# EAGLE design can_to_usb (EAGLE 5.10)
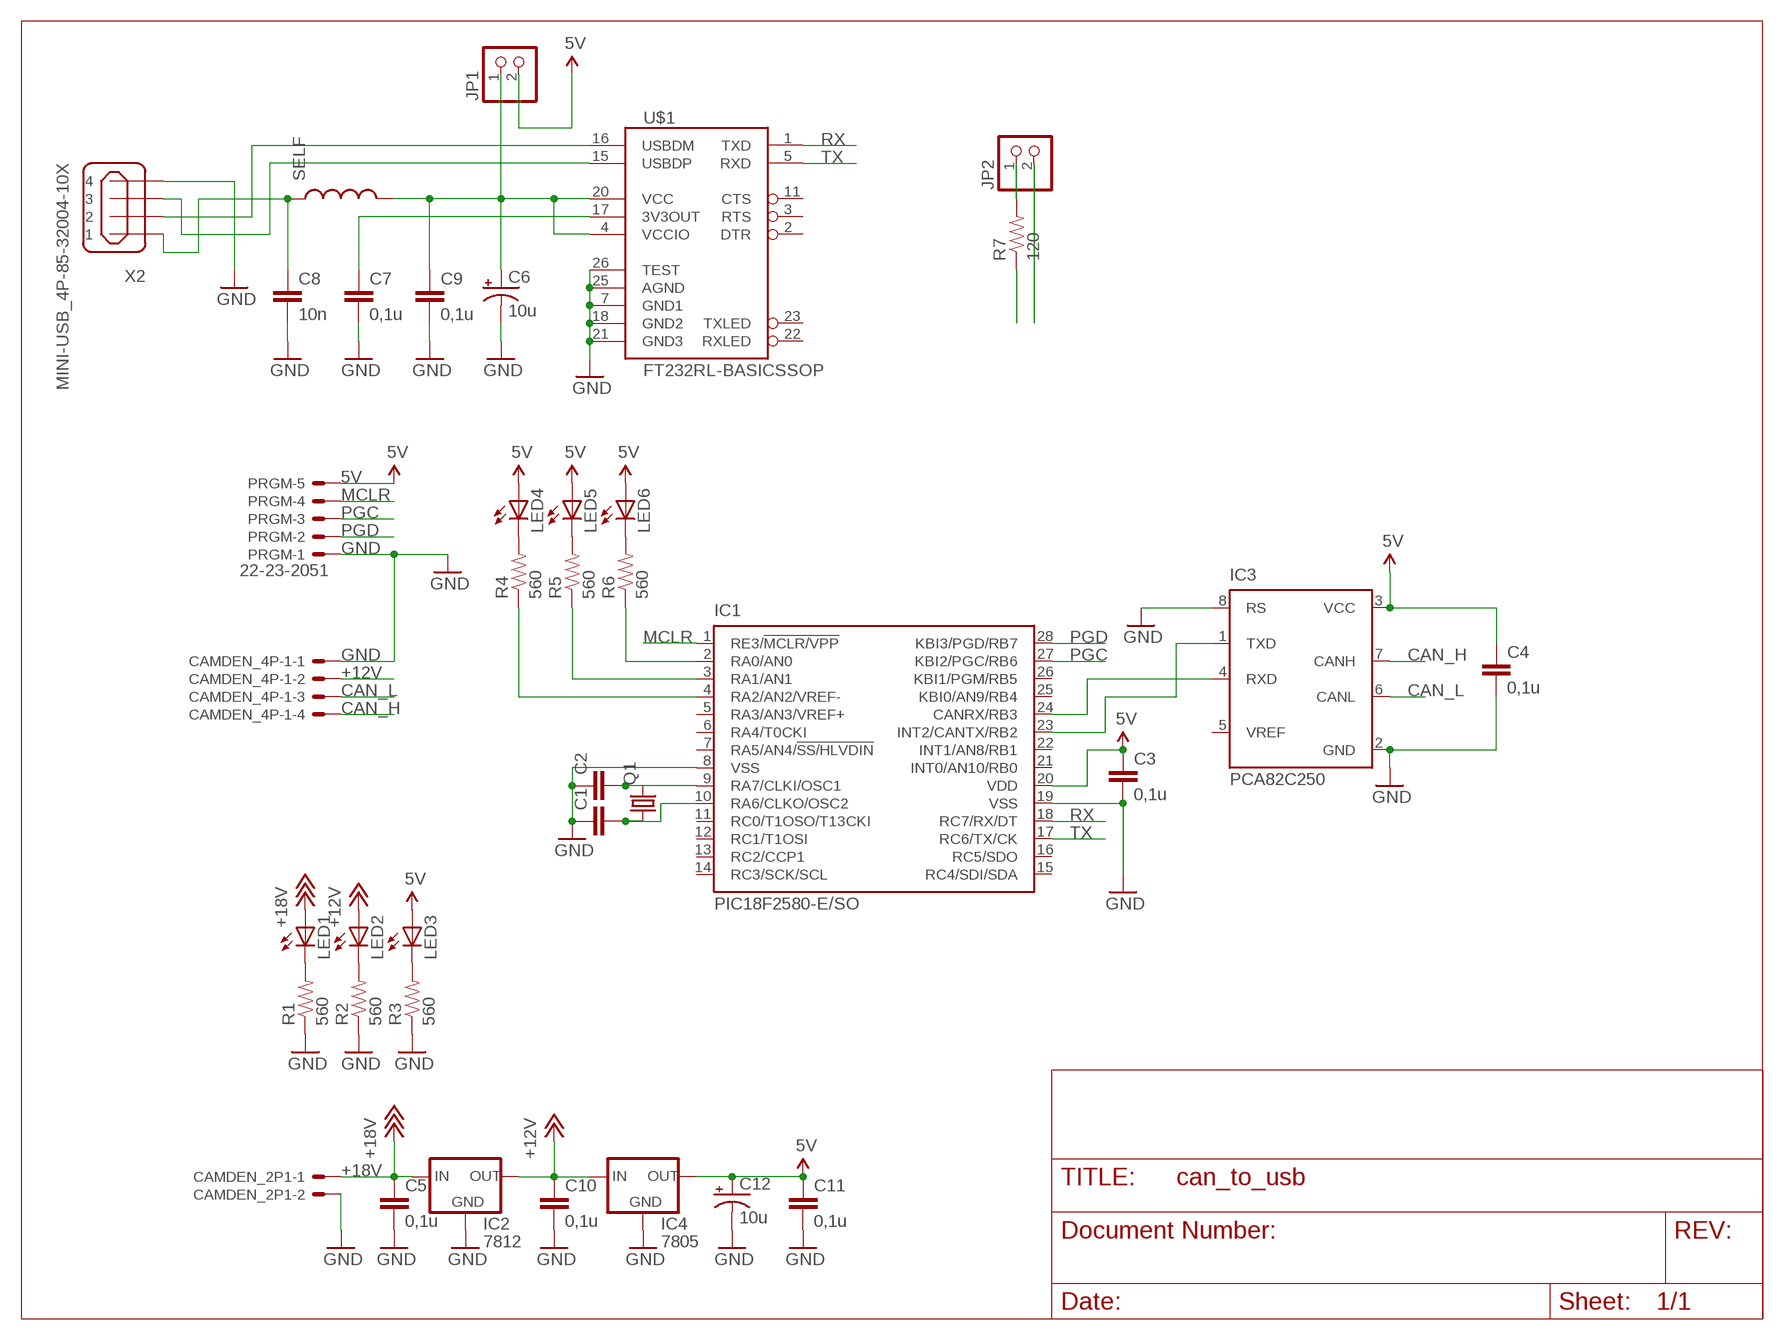
[diagram p0: schematic, sheet 1]

## Parts
C1  CAP0603  [0603]
C2  CAP0603  [0603]
C3  0,1u  CAP0603  [0603]
C4  0,1u  CAP0603  [0603]
C5  0,1u  CAP0603  [0603]
C6  10u  CAP_POL1206  [EIA3216]
C7  0,1u  CAP0603  [0603]
C8  10n  CAP0603  [0603]
C9  0,1u  CAP0603  [0603]
C10  0,1u  CAP0603  [0603]
C11  0,1u  CAP0603  [0603]
C12  10u  CAP_POL1206  [EIA3216]
CAMDEN_2P1  CTB9550-2508  [508_2]
CAMDEN_4P-1  CTB9550-4508  [508_4]
IC1  PIC18F2580-E/SO  [SO28W]
IC2  7812  78XXS  [78XXS]
IC3  PCA82C250  [DIL08]
IC4  7805  78XXS  [78XXS]
JP1  PINHD-1X2  [1X02]
JP2  PINHD-1X2  [1X02]
LED1  LED1206  [LED-1206]
LED2  LED1206  [LED-1206]
LED3  LED1206  [LED-1206]
LED4  LED1206  [LED-1206]
LED5  LED1206  [LED-1206]
LED6  LED1206  [LED-1206]
PRGM  22-23-2051  [22-23-2051]
Q1  CRYSTALHC49U-V  [HC49U-V]
R1  560  RESISTOR  [0805]
R2  560  RESISTOR  [0805]
R3  560  RESISTOR  [0805]
R4  560  RESISTOR  [0805]
R5  560  RESISTOR  [0805]
R6  560  RESISTOR  [0805]
R7  120  RESISTOR  [0805]
SELF  INDUCTOR0603  [0603]
U$1  FT232RL-BASICSSOP  [SSOP28DB]
X2  MINI-USB_4P-85-32004-10X  [85-32004-10X]

## Nets
5V: C3.1 C4.1 C11.1 C12.A(+) IC1.20(VDD) IC3.3(VCC) IC4.OUT JP1.2 LED3.A LED4.A LED5.A LED6.A PRGM.5
+12V: C10.1 CAMDEN_4P-1.P$2 IC2.OUT IC4.IN LED2.A
+18V: C5.1 CAMDEN_2P1.P$1 IC2.IN LED1.A
CAN_H: CAMDEN_4P-1.P$4 IC3.7(CANH) R7.1
CAN_L: CAMDEN_4P-1.P$3 IC3.6(CANL) JP2.2
GND: C1.1 C2.1 C3.2 C4.2 C5.2 C6.C(-) C7.2 C8.2 C9.2 C10.2 C11.2 C12.C(-) CAMDEN_2P1.P$2 CAMDEN_4P-1.P$1 IC1.8(VSS) IC1.19(VSS) IC2.GND IC3.2(GND) IC3.8(RS) IC4.GND PRGM.1 R1.1 R2.1 R3.1 U$1.7(GND1) U$1.18(GND2) U$1.21(GND3) U$1.25(AGND) U$1.26(TEST) X2.4
MCLR: IC1.1(RE3/!MCLR/VPP) PRGM.4
N$1: C2.2 IC1.9(RA7/CLKI/OSC1) Q1.2
N$2: C1.2 IC1.10(RA6/CLKO/OSC2) Q1.1
N$3: IC1.23(INT2/CANTX/RB2) IC3.1(TXD)
N$4: C8.1 SELF.1 X2.1
N$5: C6.A(+) C9.1 JP1.1 SELF.2 U$1.4(VCCIO) U$1.20(VCC)
N$6: U$1.16(USBDM) X2.2
N$7: C7.1 U$1.17(3V3OUT)
N$8: U$1.15(USBDP) X2.3
N$9: IC1.24(CANRX/RB3) IC3.4(RXD)
N$10: LED1.C R1.2
N$11: LED2.C R2.2
N$12: LED3.C R3.2
N$13: LED4.C R4.2
N$14: IC1.2(RA0/AN0) R6.1
N$15: LED5.C R5.2
N$16: LED6.C R6.2
N$17: IC1.3(RA1/AN1) R5.1
N$18: IC1.4(RA2/AN2/VREF-) R4.1
N$19: JP2.1 R7.2
PGC: IC1.27(KBI2/PGC/RB6) PRGM.3
PGD: IC1.28(KBI3/PGD/RB7) PRGM.2
RX: IC1.18(RC7/RX/DT) U$1.1(TXD)
TX: IC1.17(RC6/TX/CK) U$1.5(RXD)
Unconnected: IC1.5(RA3/AN3/VREF+) IC1.6(RA4/T0CKI) IC1.7(RA5/AN4/!SS/HLVDIN) IC1.11(RC0/T1OSO/T13CKI) IC1.12(RC1/T1OSI) IC1.13(RC2/CCP1) IC1.14(RC3/SCK/SCL) IC1.15(RC4/SDI/SDA) IC1.16(RC5/SDO) IC1.21(INT0/AN10/RB0) IC1.22(INT1/AN8/RB1) IC1.25(KBI0/AN9/RB4) IC1.26(KBI1/PGM/RB5) IC3.5(VREF) U$1.2(DTR) U$1.3(RTS) U$1.11(CTS) U$1.22(RXLED) U$1.23(TXLED)

## Library data of the parts
C1-C5 C7-C11 = SparkFun:CAP: Capacitor Standard 0603 ceramic capacitor, and 0.1" leaded capacitor.
C6 C12 = SparkFun:CAP_POL: Capacitor Polarized These are standard SMD and PTH capacitors. Normally 10uF, 47uF, and 100uF in electrolytic and tantalum varieties. Always verify the external diameter of the through hole cap, it varies with capacity, voltage, and manufacturer. The EIA devices should be standard.
CAMDEN_2P1 = mycomponents:CTB9550-2
CAMDEN_4P-1 = mycomponents:CTB9550-4
IC1 = microchip:PIC18F2*80: 28-Pin Enhanced Flash Microcontrollers with ECAN(TM) Technology 10-Bit A/D and nanoWatt Technology Source: http://www.microchip.com .. 39637a.pdf
IC2 IC4 = v-reg:78XXS: VOLTAGE REGULATOR
IC3 = micro-philips:PCA82C250: CAN CONTROLLER INTERFACE
JP1 JP2 = pinhead:PINHD-1X2: PIN HEADER
LED1-LED6 = SparkFun:LED: LEDs Standard schematic elements and footprints for 5mm, 3mm, 1206, and 0603 sized LEDs. 5mm - Spark Fun Electronics SKU : COM-00529 (and others)
PRGM = con-molex:22-23-2051: .100" (2.54mm) Center Header - 5 Pin
Q1 = crystal:CRYSTAL: CRYSTAL
R1-R7 = SparkFun:RESISTOR: Resistor Basic schematic elements and footprints for 0603, 1206, and PTH 1/10th watt (small) resistors.
SELF = SparkFun:INDUCTOR: Inductors Basic Inductor/Choke - 0603 and 1206. Footprints are not proven and vary greatly between part numbers.
U$1 = SparkFun:FT232RL-BASIC: USB UART This is the simplified version of the FT232RL unit. Only what you need, nothing you don't. Spark Fun Electronics SKU : COM-00650
X2 = con-cypressindustries:MINI-USB_4P-: MINI USB 4 Pol. Source: www.cypressindustries.com

## Board
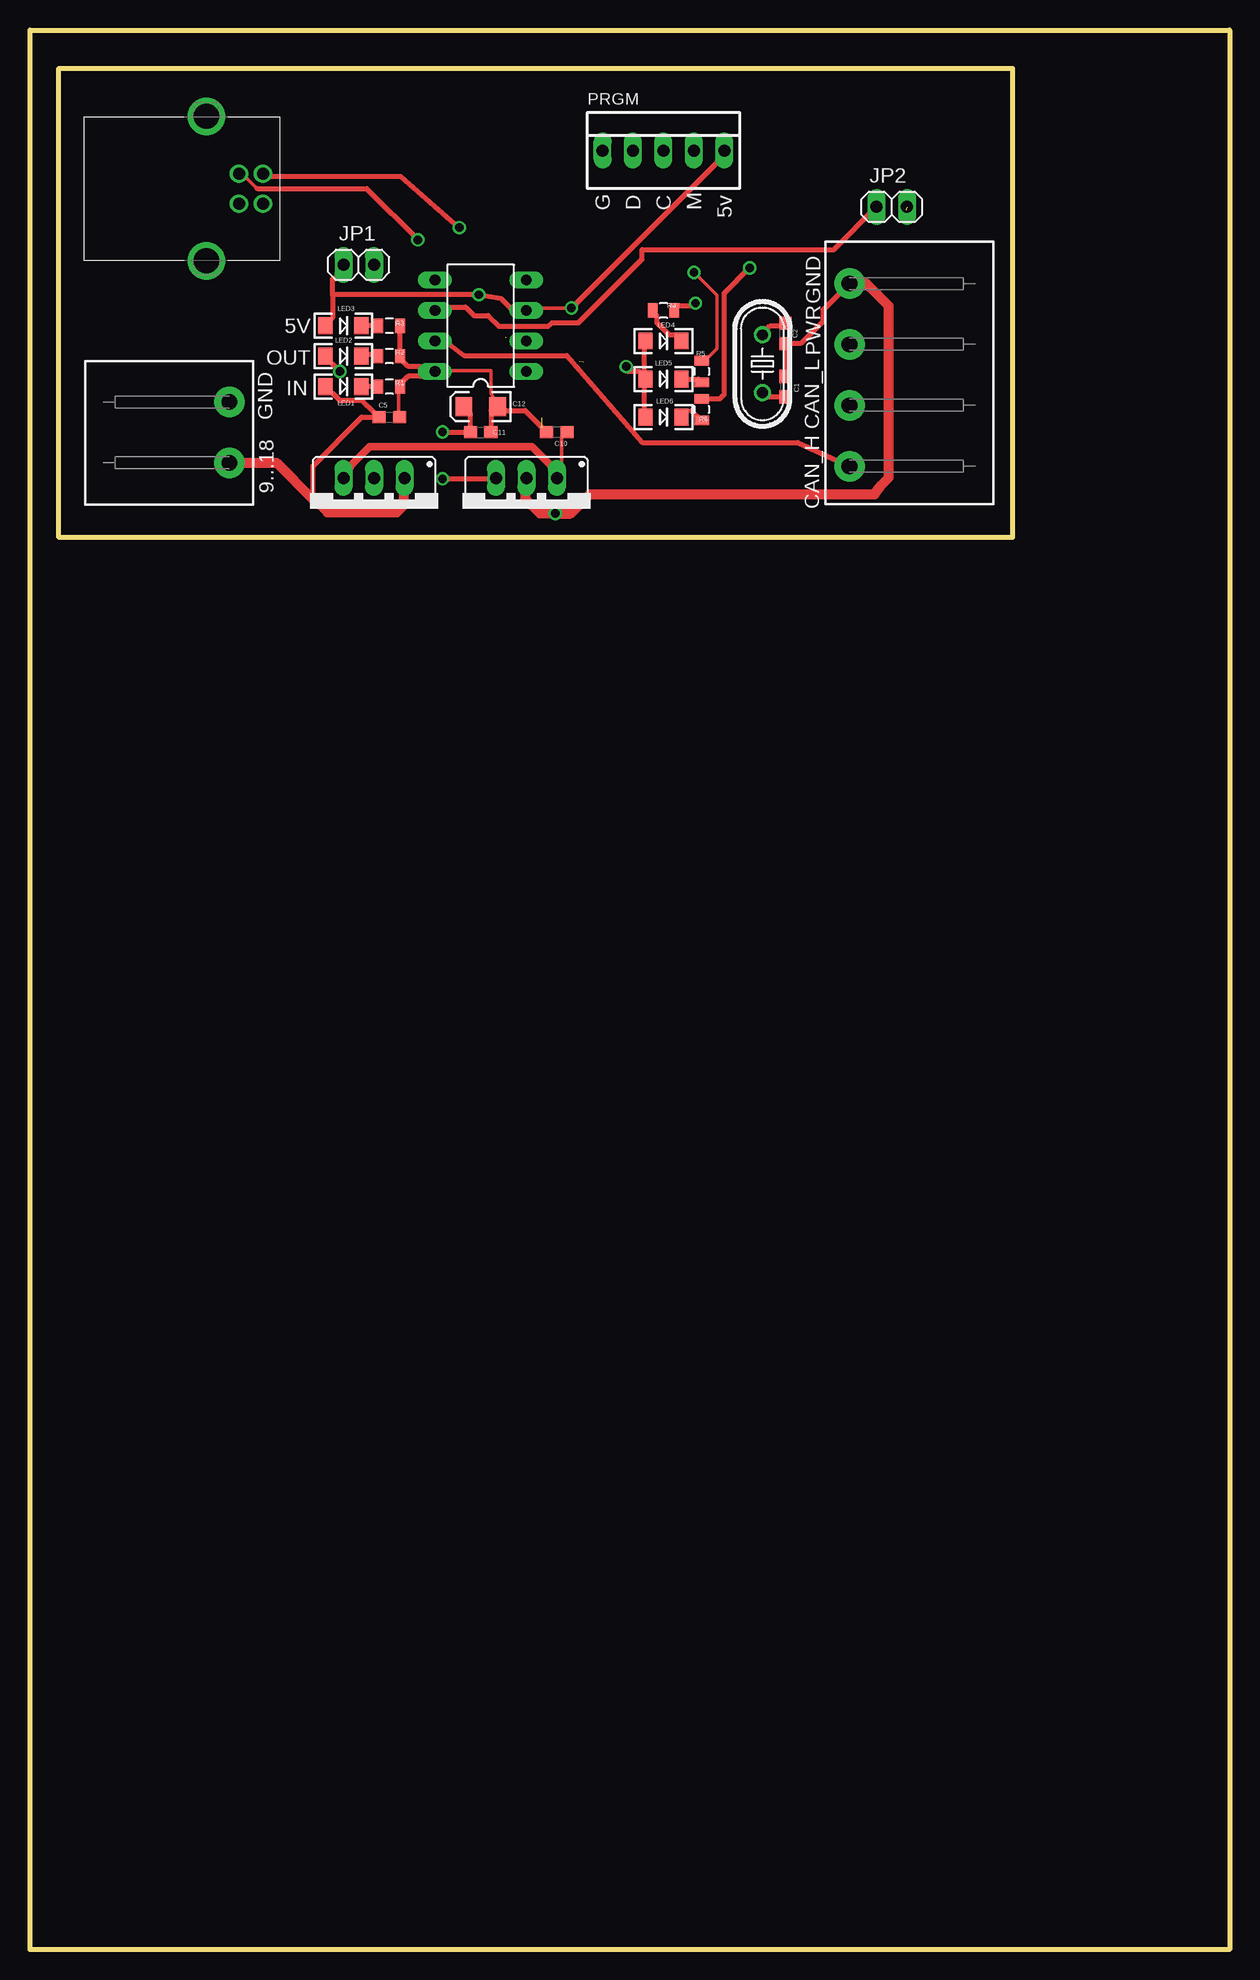
[diagram p1: board, top side]
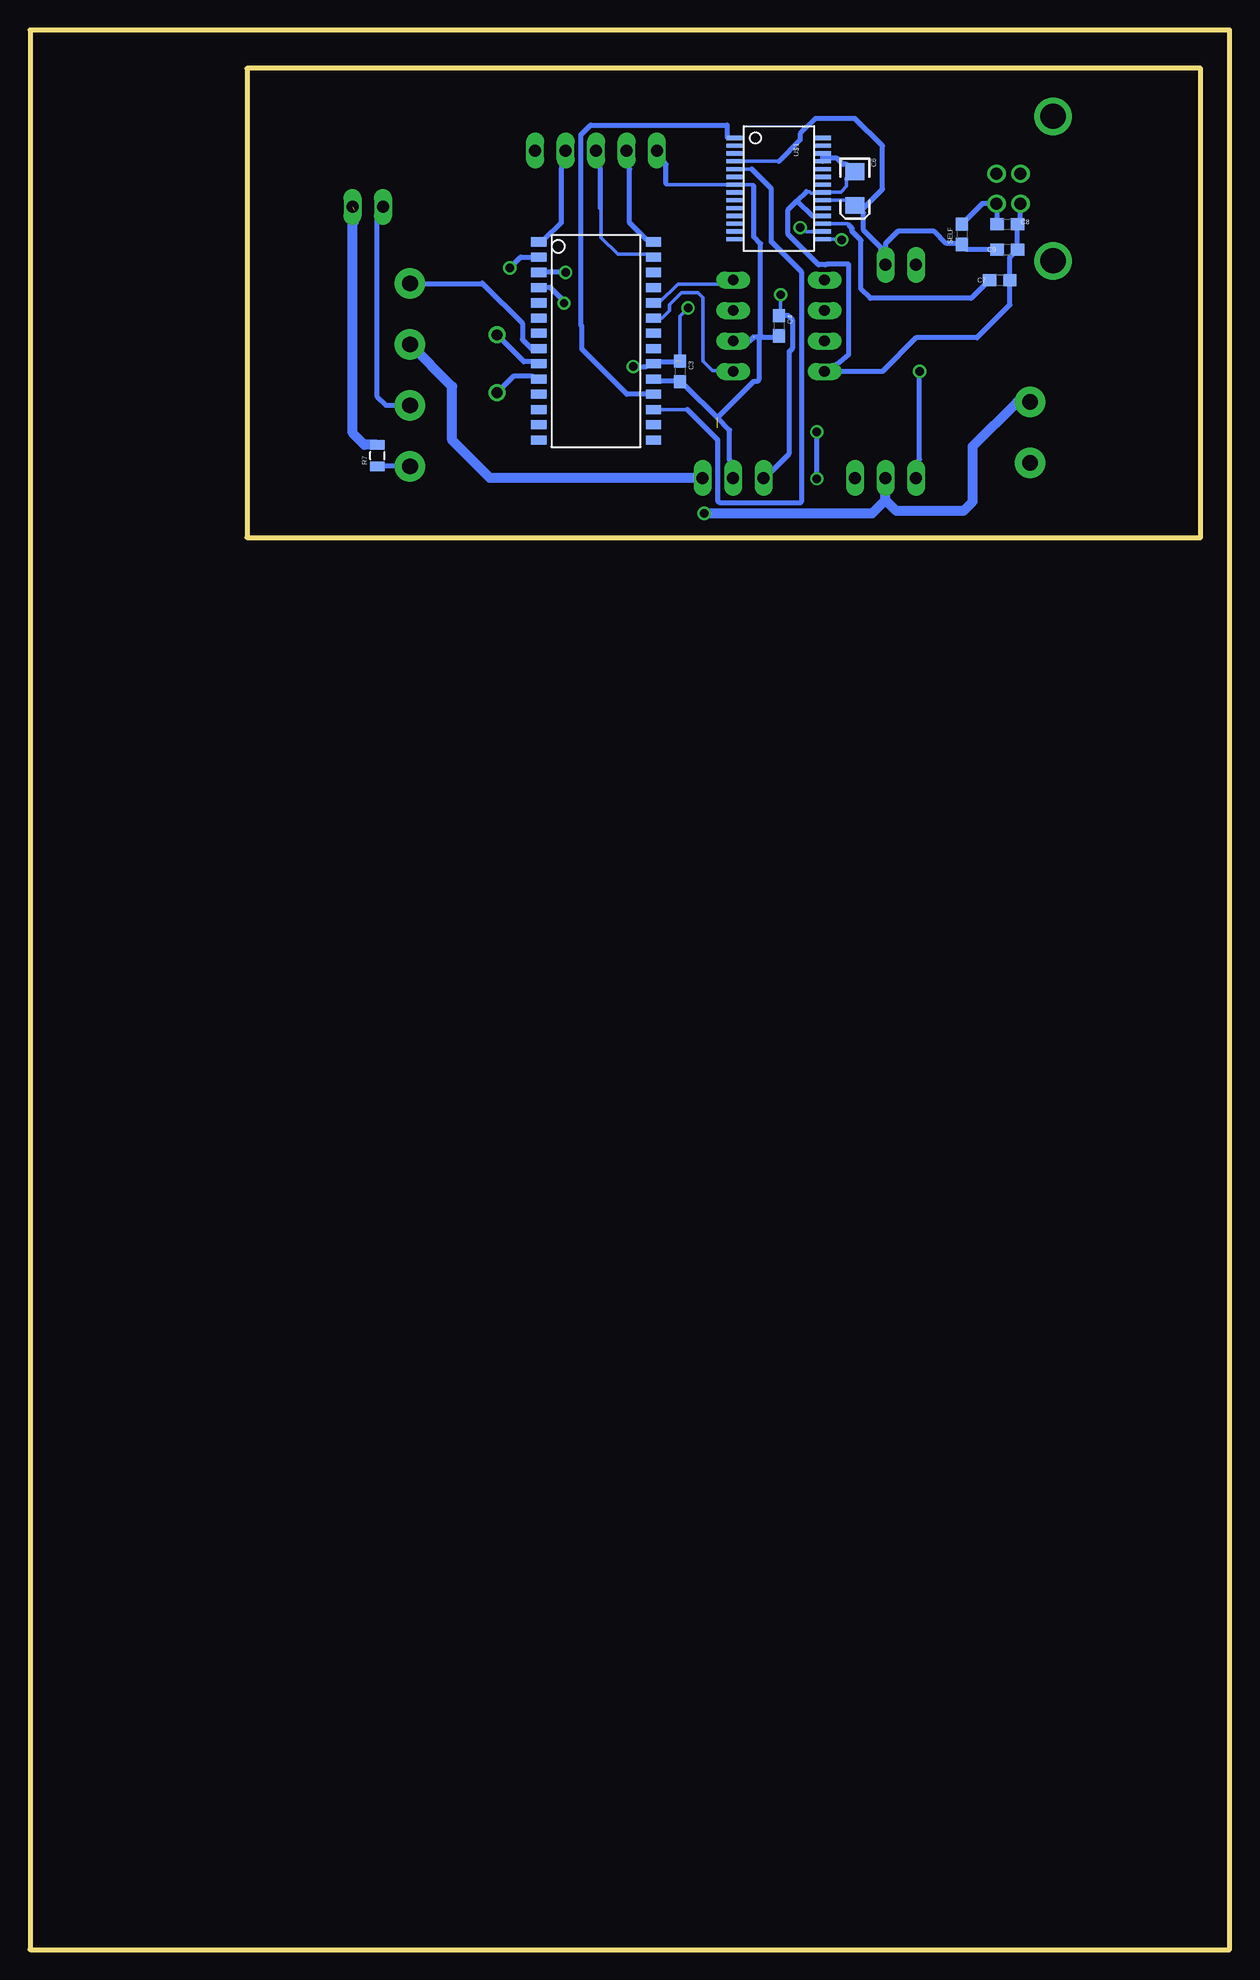
[diagram p2: board, bottom side, seen from below]

Size 100 x 160 mm. Coordinates in mm from the lower left corner, seen from the top.
Outline: 2.4,117.7 2.4,156.8 81.9,156.8 81.9,117.7 2.4,117.7
Outline: 0,160 100,160 100,0 0,0 0,160
Copper layers (1*16): Top 0.035mm / dielectric 1.5mm / Bottom 0.035mm
Design rules "10mils": minimum track width 10mil, minimum drill 24mil, track to track 10mil, track to pad 10mil, pad to pad 10mil, via to via 10mil, smd to smd 10mil, copper to edge 40mil, drill to drill 10mil, minimum pad ring 10mil, minimum via ring 8mil, stop-mask expansion 0mil, vias tented up to drill 0mil, thermal gap 10mil

### Footprints (pad centres in the part's own frame; a part is rotated, then mirrored left to right if it is on the bottom)
0603 = smd 1.1 x 1: 1 -0.85,0; 2 0.85,0
EIA3216 = smd 1.4 x 1.6: A 1.4,0; C -1.4,0
508_2 = drill 1.3 pad 2.54 round: P$1 -3.81,-5.08; P$2 1.27,-5.08
508_4 = drill 1.3 pad 2.54 round: P$1 -7.62,-5.08; P$2 -2.54,-5.08; P$3 2.54,-5.08; P$4 7.62,-5.08
SO28W = smd 0.762 x 1.27: 1 -7.62,-4.78; 2 -6.35,-4.78; 3 -5.08,-4.78; 4 -3.81,-4.78; 5 -2.54,-4.78; 6 -1.27,-4.78; 7 0,-4.78; 8 1.27,-4.78; 9 2.54,-4.78; 10 3.81,-4.78; 11 5.08,-4.78; 12 6.35,-4.78; 13 7.62,-4.78; 14 8.89,-4.78; 15 8.89,4.78; 16 7.62,4.78; 17 6.35,4.78; 18 5.08,4.78; 19 3.81,4.78; 20 2.54,4.78; 21 1.27,4.78; 22 0,4.78; 23 -1.27,4.78; 24 -2.54,4.78; 25 -3.81,4.78; 26 -5.08,4.78; 27 -6.35,4.78; 28 -7.62,4.78
78XXS = drill 1 long: GND 0,-2.54; IN -2.54,-2.54; OUT 2.54,-2.54
DIL08 = drill 0.9 long: 1 -3.81,-3.81; 2 -1.27,-3.81; 3 1.27,-3.81; 4 3.81,-3.81; 5 3.81,3.81; 6 1.27,3.81; 7 -1.27,3.81; 8 -3.81,3.81
1X02 = drill 1 long: 1 -1.27,0; 2 1.27,0
LED-1206 = smd 1.2 x 1.4: A -1.5,0; C 1.5,0
22-23-2051 = drill 1 long: 1 -5.08,0; 2 -2.54,0; 3 0,0; 4 2.54,0; 5 5.08,0
HC49U-V = drill 0.9 round: 1 -2.413,0; 2 2.413,0
0805 = smd 0.8 x 1.2: 1 -0.9,0; 2 0.9,0
SSOP28DB = smd 0.348 x 1.397: 1 -4.225,-3.656; 2 -3.575,-3.656; 3 -2.925,-3.656; 4 -2.275,-3.656; 5 -1.625,-3.656; 6 -0.975,-3.656; 7 -0.325,-3.656; 8 0.325,-3.656; 9 0.975,-3.656; 10 1.625,-3.656; 11 2.275,-3.656; 12 2.925,-3.656; 13 3.575,-3.656; 14 4.225,-3.656; 15 4.225,3.656; 16 3.575,3.656; 17 2.925,3.656; 18 2.275,3.656; 19 1.625,3.656; 20 0.975,3.656; 21 0.325,3.656; 22 -0.325,3.656; 23 -0.975,3.656; 24 -1.625,3.656; 25 -2.275,3.656; 26 -2.925,3.656; 27 -3.575,3.656; 28 -4.225,3.656
85-32004-10X = drill 1 pad 1.27 round: 1 4.71,-1.25; 2 4.71,1.25; 3 2.71,1.25; 4 2.71,-1.25 | drill 2.1 pad 3 round: M1 0,6.02; M2 0,-6.02

### Placement (x,y rotation side)
C1  62.97,130.27 270 top
C2  62.97,134.72 90 top
C3  45.83,131.54 270 bottom
C4  37.57,135.35 270 bottom
C5  29.95,127.73 0 top
C6  31.22,146.78 270 bottom
C7  19.16,139.16 0 bottom
C8  18.52,143.81 0 bottom
C9  18.52,141.7 0 bottom
C10  43.92,126.46 180 top
C11  37.57,126.46 0 top
C12  37.57,128.6 180 top
CAMDEN_2P1  11.54,127.73 90 top
CAMDEN_4P-1  73.39,131.25 270 top
DRILEGEND  [DRILEGEND]  -0.2,-4.01 0 top  (outside the outline)
IC1  52.81,134.72 270 bottom
IC2  28.68,120.11 180 top
IC3  37.57,135.35 90 top
IC4  41.38,120.11 180 top
JP1  27.41,140.43 180 top
JP2  71.85,145.25 180 top
LED1  26.14,130.27 0 top
LED2  26.14,132.81 0 top
LED3  26.14,135.35 0 top
LED4  52.81,134.08 0 top
LED5  52.81,130.91 0 top
LED6  52.81,127.73 0 top
PRGM  52.81,149.96 0 top
Q1  61.06,132.18 90 top
R1  29.95,130.27 180 top
R2  29.95,132.81 180 top
R3  29.95,135.35 180 top
R4  52.81,136.62 180 top
R5  55.98,131.54 270 top
R6  55.98,128.37 270 top
R7  71.05,124.53 90 bottom
SELF  22.33,142.97 270 bottom
U$1  37.57,146.78 270 bottom
X2  14.71,146.78 0 top

### Tracks (layer width: path | path; a pad name or v marks a point on that pad's centre or on a via)
5V  (via drill 0.7, 0.7 pad 0.25)  (1 unrouted)
  Top 0.305: LED6.A 51.23,128.29 | 51.23,130.32 LED5.A | 51.23,133.57 LED4.A | LED5.A 51.23,131.54 | LED5.A 50.83,131.54 | 25.23,139.26 25.43,139.26 | v45.14,136.82 42.7,136.82 IC3.3
  Top 0.406: 51.23,128.29 51.23,130.32 | 51.23,131.54 51.23,133.57 | v49.71,131.95 49.81,131.54 50.83,131.54 | 25.23,137.94 25.23,139.26 | 25.23,137.94 25.23,136.01 LED3.A | 25.43,139.26 JP1.2 | 25.23,137.94 v37.42,137.94 39.25,137.64 40.06,136.82 IC3.3 | v45.14,136.82 57.13,148.81 PRGM.5 | C12.A 36.72,128.05 C11.1 34.44,126.46 v34.4,126.5 | v34.4,122.6 38.79,122.6 IC4.OUT
  Bottom 0.305: 47.58,132.35 IC1.20 48.59,131.95 | v37.42,137.94 37.42,136.62 C4.1 | C3.1 45.83,136.14 v45.14,136.82
  Bottom 0.406: 47.58,132.35 46.16,132.35 | v49.71,131.95 48.59,131.95 | IC4.OUT 38.75,122.65 36.7,124.7 36.7,133.2 36.4,133.5 36.4,135.8 36.8,136.2 C4.1 | v34.4,122.6 v34.4,126.5
+12V  (via drill 0.7)
  Top 0.305: C10.1 44.33,126.05 44.33,124.02 IC4.IN | 25.23,132.15 LED2.A
  Top 0.406: v25.84,131.54 25.23,132.15
  Top 0.61: IC4.IN 43.31,123.82 41.86,125.27 28.3,125.27 26.85,123.82 IC2.OUT
  Bottom 0.406: v25.84,131.54 25.84,124.22 IC2.OUT
  Bottom 0.813: IC4.IN 61.65,122.65 64.8,125.8 64.8,130.28 CAMDEN_4P-1.P$2
+18V
  Top 0.305: C5.1 28.68,128.09 | 25.23,129.71 LED1.A
  Top 0.406: 28.68,128.09 27.66,129.1 25.84,129.1 25.23,129.71 | C5.1 27.66,127.73 23.6,123.67 23.6,120.87
  Top 0.813: CAMDEN_2P1.P$1 20.55,123.92 23.6,120.87 23.73,120.87 24.8,119.8 30.6,119.8 31.2,120.4 31.2,122.63 IC2.IN
CAN_H
  Top 0.406: IC3.7 34.98,133.78 36.2,132.86 44.73,132.86 51.03,125.62 64.04,125.62 CAMDEN_4P-1.P$4
  Bottom 0.406: R7.1 68.32,123.63 CAMDEN_4P-1.P$4
CAN_L
  Top 0.406: IC3.6 34.04,136.9 36.3,136.9 37,136.2 38.2,136.2 39.1,135.3 43.2,135.3 43.5,135.6 45.75,135.6 51.03,140.89 51.03,141.7 67.03,141.7 JP2.2
  Bottom 0.406: CAMDEN_4P-1.P$3 70.31,128.72 71.1,129.5 71.1,144.73 JP2.2
GND  (via drill 0.7 pad 0.25)  (2 unrouted)
  Top 0.305: 42.7,126.87 C10.2 | 38.43,126.87 C11.2 | 38.43,128.29 C12.C 38.43,129.71 38.43,131.59 34.98,131.59 IC3.8 | C5.2 30.71,128.09 30.71,129.71 R1.1 31.12,130.73
  Top 0.406: 42.7,126.87 41.28,128.29 39.65,128.29 C12.C | 38.43,128.29 38.43,126.87 | 31.12,130.73 31.52,131.13 32.54,131.13 IC3.8 32.54,131.95 31.52,131.95 31.12,132.35 R2.1 R3.1 | C2.1 C1.1 | C2.1 63.3,133.87 | C2.1 64.27,133.87 66.1,135.7 66.1,136.66 CAMDEN_4P-1.P$1
  Top 0.813: IC4.GND 41.3,122.57 41.3,120.9 42.5,119.7 v43.8,119.7 45.1,119.7 46.7,121.3 70.4,121.3 71,122.1 71.6,122.7 71.6,137 69.72,138.88 CAMDEN_4P-1.P$1
  Bottom 0.305: 46.16,130.73 C3.2 45.34,130.32 | 47.58,130.73 IC1.19 | IC3.8 32.74,132.15 | U$1.7 40.79,147.1 | 35.28,146.53 35.03,146.53 34.9,146.4 33.97,146.4 U$1.21 33.87,146.5 32.4,146.5 31.93,146.97 31.93,147.59 | 39.65,146.98 39.65,147.05 39.7,147.1 U$1.7 | U$1.7 46.89,147.1 46.97,147.19
  Bottom 0.406: IC1.8 58.14,133.38 58.96,134.19 58.96,135.56 62.27,138.88 | 46.16,130.73 47.58,130.73 | 42.7,127.68 41.69,126.66 41.69,124.22 IC4.GND | 42.7,127.68 45.34,130.32 | 46.97,147.19 46.97,148.81 PRGM.1 | 31.93,147.59 C6.C 31.93,148.81 32.24,148.81 32.74,149.32 33.65,149.32 U$1.25 U$1.26 | 39.3,134.38 39.65,134.38 | 39.3,134.38 38.03,134.38 C4.2 | 32.74,132.15 31.73,132.96 31.73,140.48 33.56,140.48 33.71,140.43 34.27,140.43 36.81,142.97 36.81,145 36.05,145.76 | 42.7,127.68 39.65,130.73 39.37,130.73 39.2,130.9 39.2,134.28 39.3,134.38 | X2.4 17.42,143.85 C8.2 C9.2 18.3,141.06 C7.2 18.3,137.09 21.06,134.33 26.14,134.33 28.93,131.54 IC3.8 | 36.05,145.76 35.28,146.53 | U$1.18 34.79,144.5 36.05,145.76 | 62.27,138.88 62.3,138.9 | 39.7,134.3 39.7,134.4 40.02,134.08 IC3.2 | 39.65,146.98 39.65,142.75 39.1,142.2 39.1,134.59 39.3,134.38 | CAMDEN_4P-1.P$1 62.27,138.88
  Bottom 0.813: 28.68,120.82 IC2.GND 28.7,122.67 | 28.68,120.82 29.8,119.7 v43.8,119.7 | IC4.GND 41.3,122.57 | CAMDEN_2P1.P$2 17.7,129 21.4,125.3 21.4,120.7 22.2,119.9 27.76,119.9 28.68,120.82
MCLR
  Bottom 0.406: IC1.1 57.13,142.51 55.71,143.94 55.71,148.41 PRGM.4
N$1
  Top 0.406: Q1.2 61.06,134.72 61.7,135.35 62.76,135.35 C2.2
  Bottom 0.406: IC1.9 58.14,132.35 58.83,132.35 Q1.2
N$2
  Top 0.406: C1.2 61.41,129.42 Q1.1
  Bottom 0.406: IC1.10 58.14,131.13 59.69,131.13 Q1.1
N$3
  Bottom 0.305: IC1.23 47.31,135.99 46.7,136.6 46.7,137.1 45.7,138.1 44.3,138.1 43.9,137.7 43.9,132.4 43.1,131.6 41.44,131.6 IC3.1
N$4
  Bottom 0.406: C8.1 19.37,145.48 X2.1 20.62,145.53 SELF.1
N$5
  Bottom 0.305: 37.58,149.06 U$1.4 | U$1.20 31.64,145.81 C6.A
  Bottom 0.406: 30.73,144.95 C6.A | 30.73,144.95 30.51,144.75 30.51,143.33 29.09,141.9 JP1.1 28.68,142.21 27.66,143.22 24.62,143.22 23.6,142.21 22.42,142.21 SELF.2 21.91,141.7 C9.1 | 37.58,149.06 35.79,150.84 35.79,151.35 34.52,152.62 31.22,152.62 28.93,150.34 28.93,146.75 30.73,144.95
N$6  (via drill 0.7)
  Top 0.254: 19.94,147.8 19.65,147.8 X2.2
  Top 0.406: v35.79,143.53 30.91,147.8 19.94,147.8
  Bottom 0.305: U$1.16 35.27,143.21 v35.79,143.53
N$7
  Bottom 0.305: U$1.17 31.85,143.85 31.73,143.73
  Bottom 0.406: 31.73,143.73 31.47,143.48 31.47,143.22 30.71,142.46 30.71,138.4 29.95,137.64 21.53,137.64 C7.1
N$8  (via drill 0.7)
  Top 0.305: 18.93,146.78 17.91,147.8 17.65,147.8 X2.3
  Top 0.406: v32.34,142.51 28.07,146.78 18.93,146.78
  Bottom 0.305: U$1.15 32.38,142.56 v32.34,142.51
N$9
  Bottom 0.305: IC1.24 47.55,137.25 46,138.8 41.74,138.8 IC3.4
N$10
  Top 0.305: 28.68,130.32 R1.2 | LED1.C 28.07,130.32
  Top 0.406: 28.07,130.32 28.68,130.32
N$11
  Top 0.305: 28.68,132.96 R2.2 | LED2.C 28.07,132.96
  Top 0.406: 28.07,132.96 28.68,132.96
N$12
  Top 0.305: 28.68,135.4 R3.2 | LED3.C 28.07,135.4
  Top 0.406: 28.07,135.4 28.68,135.4
N$13
  Top 0.305: 52.25,136.21 R4.2 | 53.88,134.59 LED4.C
  Top 0.406: 52.25,136.21 52.25,135.6 53.27,134.59 53.88,134.59
N$14  (via drill 0.7 pad 0.3)
  Top 0.406: R6.1 57.52,129.26 57.89,129.63 57.89,138.06 v59.99,140.17
  Bottom 0.406: IC1.2 59.1,141.06 v59.99,140.17
N$15
  Top 0.406: LED5.C 55.72,130.91 R5.2
N$16
  Top 0.305: 55.3,128.29 55.16,128.29 54.89,128.29 LED6.C
  Top 0.406: 55.16,128.29 R6.2
N$17  (via drill 0.7 pad 0.3)
  Top 0.305: 56.25,132.44 57.26,133.44 57.26,137.89 v55.35,139.79
  Top 0.406: R5.1 56.25,132.44
  Bottom 0.406: v55.35,139.79 IC1.3
N$18  (via drill 0.7)
  Top 0.305: R4.1 54.08,137.03
  Top 0.406: 54.08,137.03 55.27,137.03 v55.48,137.23
  Bottom 0.406: v55.48,137.23 55.48,137.38 56.62,138.53 IC1.4
N$19  (1 unrouted)
  Bottom 0.813: R7.2 72.13,125.43 73.1,126.4 73.1,145.23 JP2.1 | 73.1,143.9 73,144 73,144.97
PGC
  Bottom 0.305: 52.45,145.15 52.4,145.1 52.4,142.7 50.99,141.29 48.59,141.29 48.37,141.06 IC1.27
  Bottom 0.406: 52.45,145.15 52.45,148.41 PRGM.3
PGD
  Bottom 0.305: IC1.28 48.42,142.34 48.59,142.51
  Bottom 0.406: 48.59,142.51 50.02,143.94 50.02,148.41 PRGM.2
RX
  Bottom 0.305: 41.89,151.05 U$1.1
  Bottom 0.406: 41.89,151.05 41.89,152.06 53.27,152.06 54.08,151.25 54.08,135.4 54,135.32 54,133.4 50.23,129.63 IC1.18
TX
  Bottom 0.305: 47.58,128.09 IC1.17 45.19,128.37 | 39.83,148.41 U$1.5
  Bottom 0.406: 39.83,148.41 38.2,146.78 38.2,142.34 35.66,139.79 35.66,120.69 35.79,120.57 42.47,120.57 42.65,120.75 42.65,125.83 45.19,128.37

### Text on the board
tPlace: G | D | C | M | 5v | GND | 5V | OUT | PWR | IN | GND | CAN_L | 9...18 | CAN_H